# EAGLE design gadtoanalog (EAGLE 6.2)
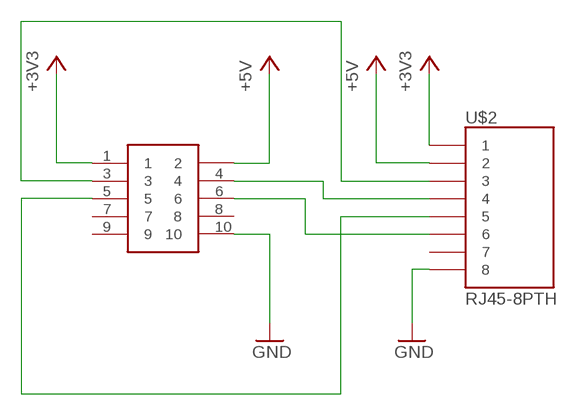
[diagram p0: schematic, sheet 1]

## Parts
U$1  SHF105SM  [SHF105DSM]
U$2  RJ45-8PTH  [RJ45-8]

## Nets
+3V3: U$1.1 U$2.1
+5V: U$1.2 U$2.2
GND: U$1.10 U$2.8
N$1: U$1.3 U$2.3
N$2: U$1.4 U$2.4
N$3: U$1.5 U$2.5
N$4: U$1.6 U$2.6
Unconnected: U$1.7 U$1.8 U$1.9 U$2.7

## Library data of the parts
U$1 = ozlollc:SHF105
U$2 = SparkFun-Connectors:RJ45-8: RJ45 Jack Simple RJ45, 8-pin connection - connector for common Cat5, Cat5e, and Cat6 Ethernet cables. Footprint not yet proven in production. Connector sku is PRT-00643; Breakout PCB sku is BOB-00716.

## Board
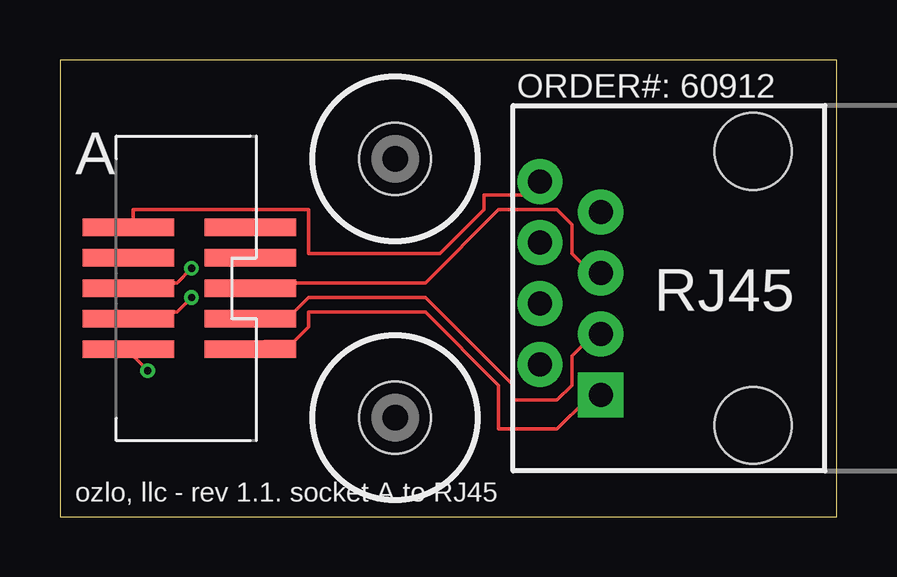
[diagram p1: board, top side]
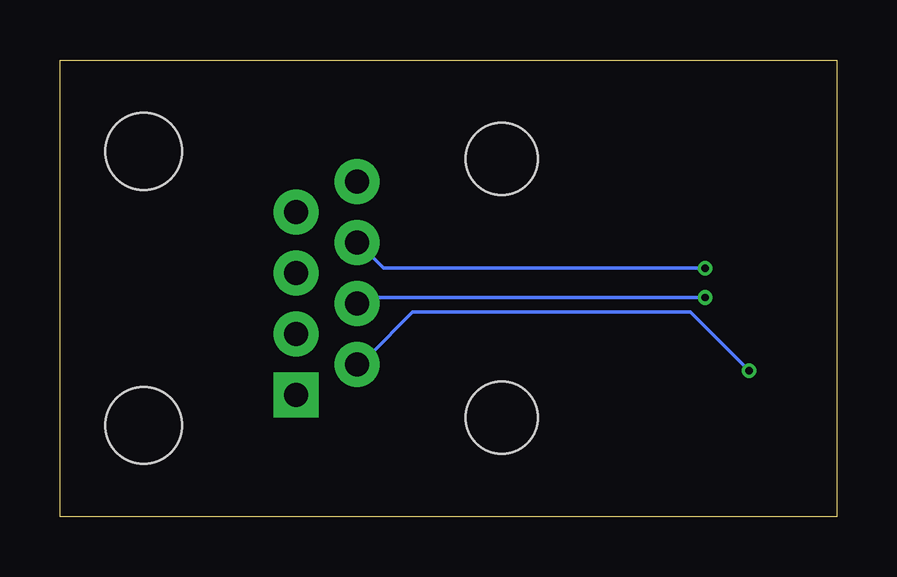
[diagram p2: board, bottom side, seen from below]

Size 32.38 x 19.05 mm. Coordinates in mm from the lower left corner, seen from the top.
Outline: 0,0 32.38,0 32.38,19.05 0,19.05 0,0
Copper layers (1*16): Top 0.035mm / dielectric 1.5mm / Bottom 0.035mm
Design rules: minimum track width 6mil, minimum drill 12mil, track to track 6mil, track to pad 6mil, pad to pad 6mil, via to via 6mil, smd to smd 0mil, copper to edge 10mil, drill to drill 10mil, minimum pad ring 10mil, minimum via ring 6mil, stop-mask expansion 2mil, vias tented up to drill 100mil, thermal gap 10mil

### Footprints (pad centres in the part's own frame; a part is rotated, then mirrored left to right if it is on the bottom)
SHF105DSM = smd 3.81 x 0.737: 1 -2.54,2.54; 2 2.54,2.54; 3 -2.54,1.27; 4 2.54,1.27; 5 -2.54,0; 6 2.54,0; 7 -2.54,-1.27; 8 2.54,-1.27; 9 -2.54,-2.54; 10 2.54,-2.54
RJ45-8 = drill 1 pad 1.88 square: 1 -4.445,6.35 | drill 1 pad 1.88: 2 -3.175,8.89; 3 -1.905,6.35; 4 -0.635,8.89; 5 0.635,6.35; 6 1.905,8.89; 7 3.175,6.35; 8 4.445,8.89 | hole 3.2: -5.715,0; 5.715,0
DRIL-3 = hole 3: 0,0

### Placement (x,y rotation side)
U$1  5.4,9.53 180 top
U$2  28.89,9.53 90 top
U$3  [DRIL-3]  13.97,4.13 0 top
U$4  [DRIL-3]  13.97,14.92 0 top

### Tracks (layer width: path | path; a pad name or v marks a point on that pad's centre or on a via)
+3V3
  Top 0.152: U$2.1 21.95,4.88 20.73,3.66 18.29,3.66 18.29,5.49 15.24,8.53 10.36,8.53 10.36,7.92 9.75,7.32 8.53,7.32 U$1.1
+5V  (via drill 0.3)
  Top 0.152: v3.66,6.1 3.05,6.71 U$1.2
  Bottom 0.152: v3.66,6.1 6.1,8.53 17.68,8.53 19.51,6.71 U$2.2
GND
  Top 0.152: U$2.8 19.51,13.41 17.68,13.41 17.68,12.8 15.85,10.97 10.36,10.97 10.36,12.8 3.05,12.8 3.05,12.19 U$1.10
N$1
  Top 0.152: U$2.3 21.95,7.32 21.34,6.71 21.34,5.49 20.73,4.88 18.9,4.88 18.9,5.49 15.24,9.14 10.36,9.14 9.75,8.53 8.53,8.53 U$1.3
N$2  (via drill 0.3)
  Top 0.152: v5.49,9.14 4.88,8.53 3.05,8.53 U$1.4
  Bottom 0.152: v5.49,9.14 19.51,9.14 U$2.4
N$3
  Top 0.152: U$2.5 21.95,10.36 21.34,10.97 21.34,12.19 20.73,12.8 18.29,12.8 15.24,9.75 8.53,9.75 U$1.5
N$4  (via drill 0.3)
  Top 0.152: v5.49,10.36 4.88,9.75 3.05,9.75 U$1.6
  Bottom 0.152: v5.49,10.36 18.9,10.36 19.51,10.97 U$2.6

### Text on the board
tNames: ORDER#: 60912 | A | RJ45 | ozlo, llc - rev 1.1. socket A to RJ45